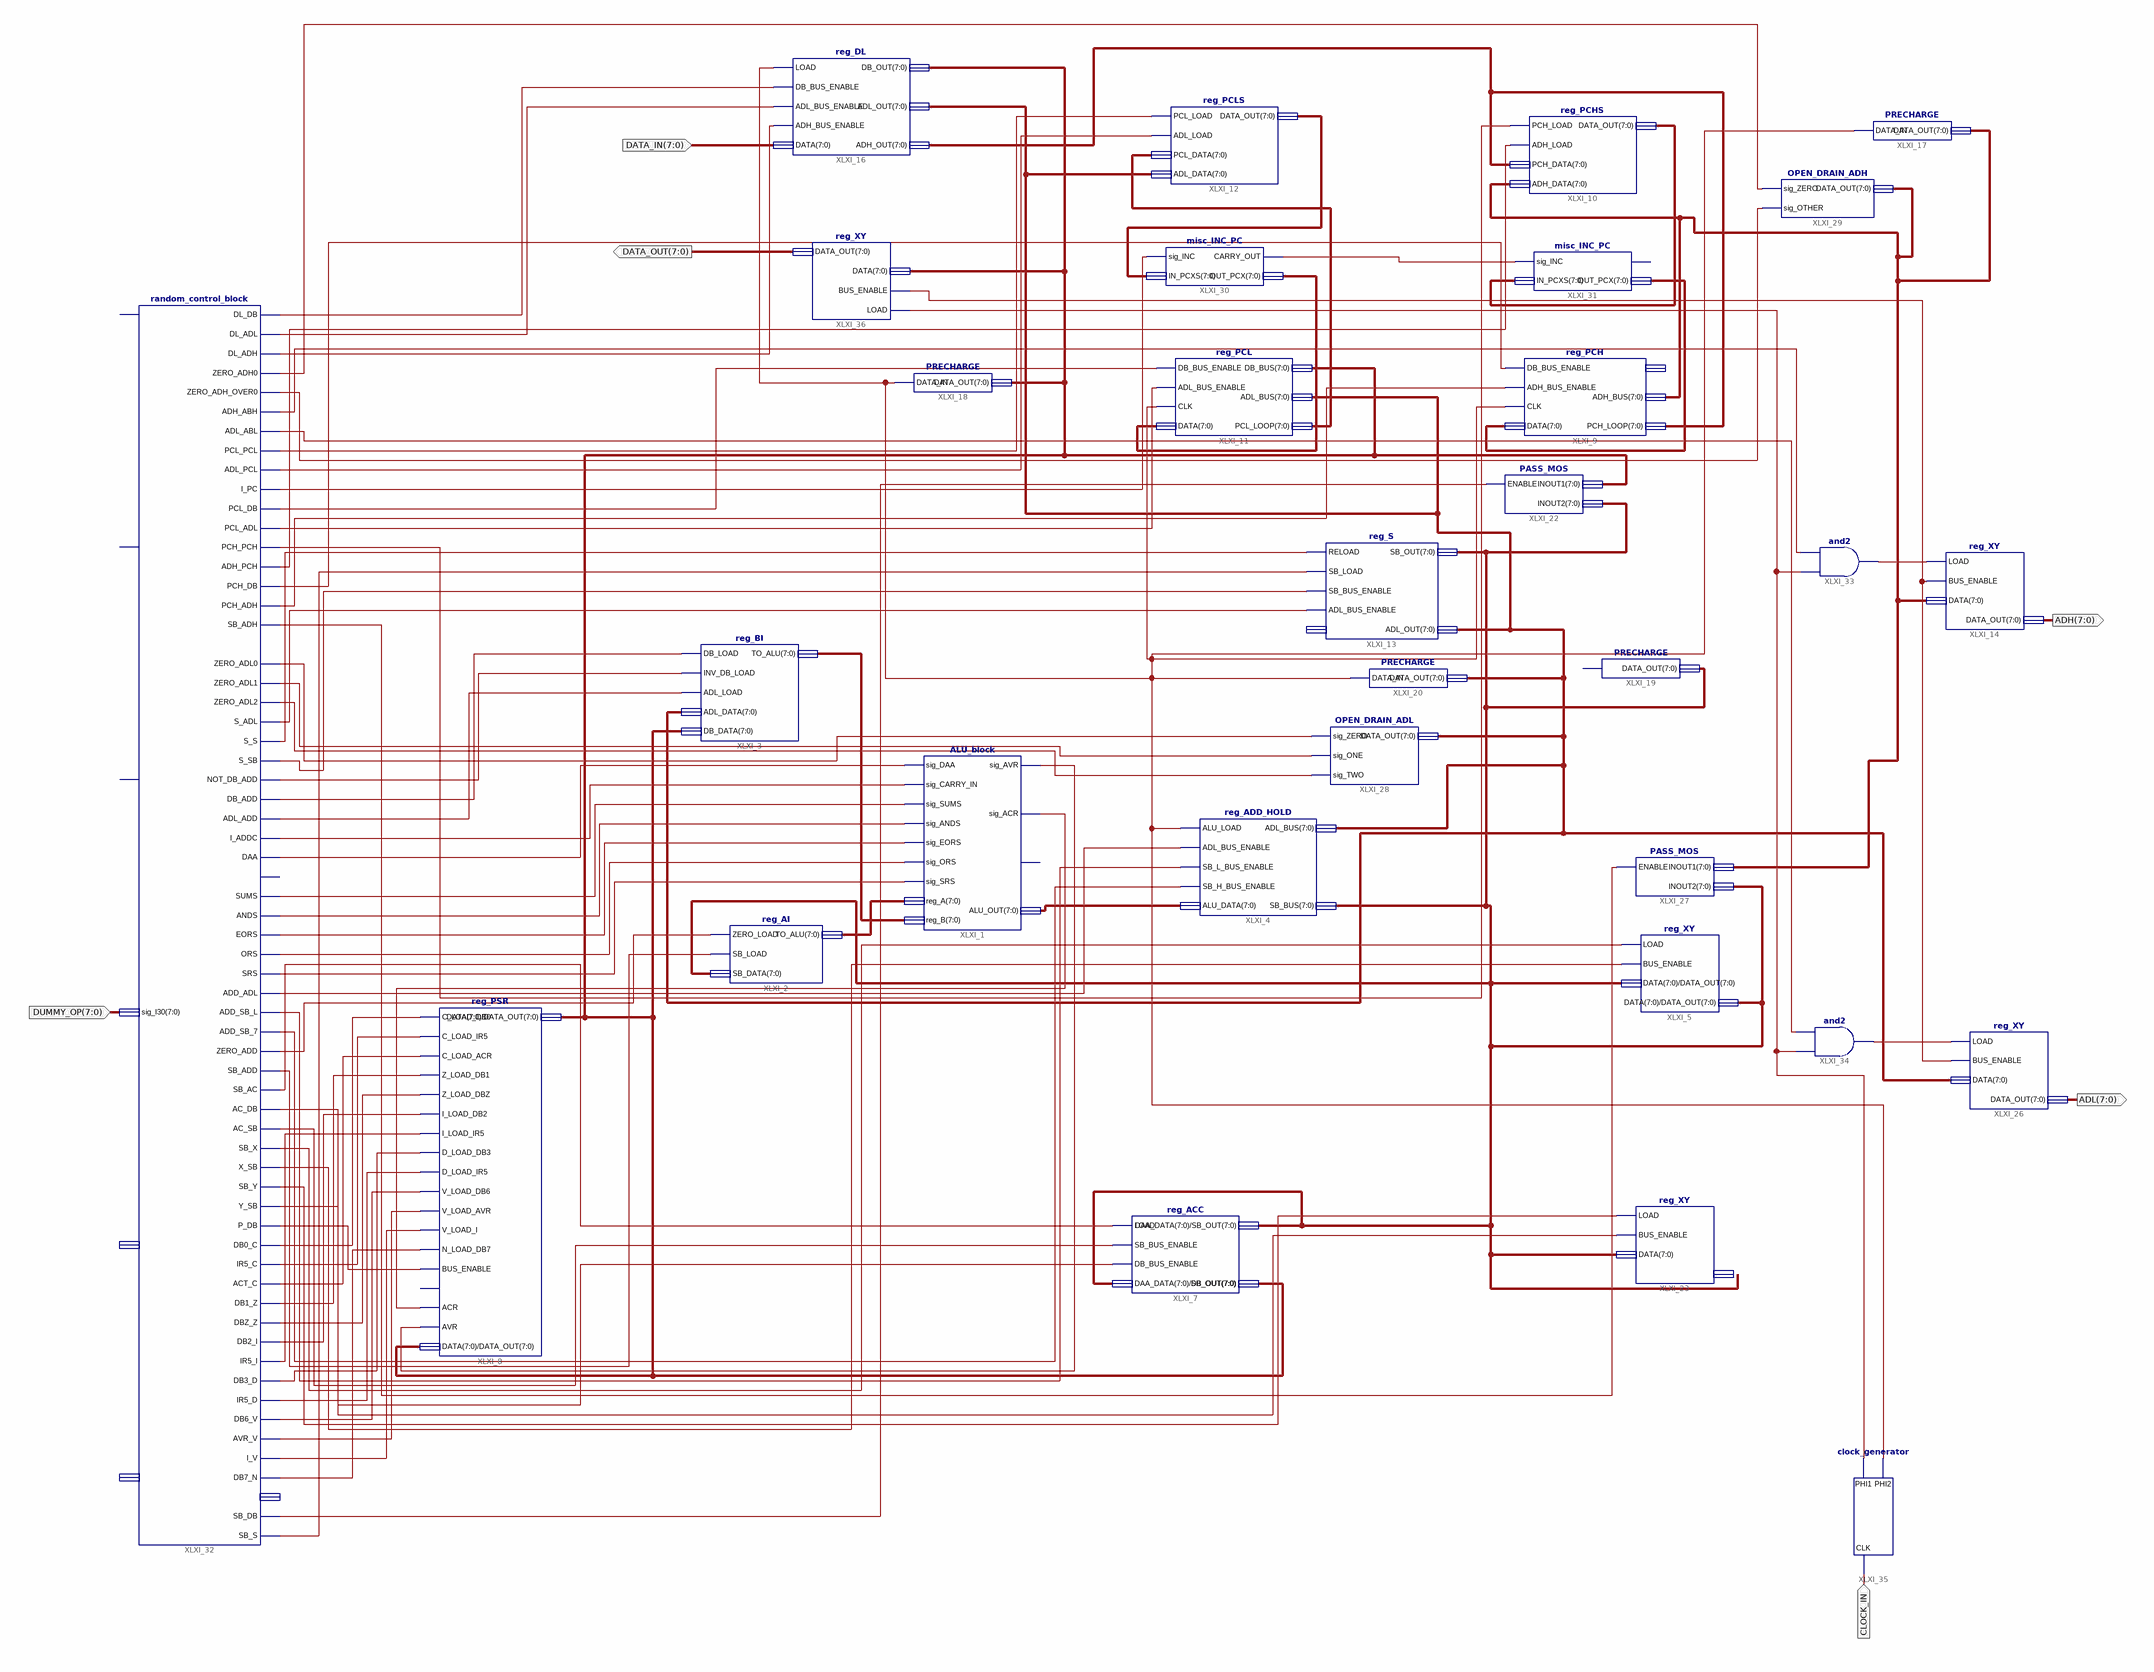
[diagram p0: schematic sheet 1]
// Xilinx ISE schematic cpu_dummy_one.sch (spartan6) as structural Verilog: 31 symbols, 6 ports
module cpu_dummy_one (
  input  [7:0] DATA_IN,
  input  CLOCK_IN,
  input  [7:0] DUMMY_OP,
  output [7:0] DATA_OUT,
  output [7:0] ADH,
  output [7:0] ADL
);

  wire XLXN_36, XLXN_37, XLXN_38, XLXN_39, XLXN_40, XLXN_41, XLXN_45, XLXN_46, XLXN_47, XLXN_48, XLXN_49,
       XLXN_50, XLXN_51, XLXN_52, XLXN_53, XLXN_54, XLXN_55, XLXN_56, XLXN_57, XLXN_59, XLXN_74, XLXN_75,
       XLXN_76, XLXN_77, XLXN_78, XLXN_79, XLXN_80, XLXN_81, XLXN_82, XLXN_83, XLXN_84, XLXN_85, XLXN_86,
       XLXN_87, XLXN_88, XLXN_91, XLXN_92, XLXN_93, XLXN_94, XLXN_95, XLXN_96, XLXN_97, XLXN_98, XLXN_99,
       XLXN_100, XLXN_101, XLXN_102, XLXN_103, XLXN_104, XLXN_105, XLXN_106, XLXN_107, XLXN_108, XLXN_109,
       XLXN_110, XLXN_111, XLXN_112, XLXN_113, XLXN_114, XLXN_115, XLXN_116, XLXN_117, XLXN_118, XLXN_119,
       XLXN_120, XLXN_219, XLXN_221, XLXN_228, XLXN_231;
  wire [7:0] XLXN_1, XLXN_2, XLXN_3, XLXN_5, XLXN_7, XLXN_8, XLXN_11, XLXN_17, XLXN_18, XLXN_32, XLXN_33,
       XLXN_34, XLXN_35;

  ALU_block XLXI_1 (
    .sig_DAA(XLXN_86), .sig_CARRY_IN(XLXN_85), .sig_SUMS(XLXN_87), .sig_ANDS(XLXN_88), .sig_EORS(XLXN_91),
    .sig_ORS(XLXN_92), .sig_SRS(XLXN_93), .reg_A(XLXN_1), .reg_B(XLXN_2), .sig_AVR(XLXN_95),
    .sig_ACR(XLXN_94), .ALU_OUT(XLXN_7));  // open: sig_HC
  reg_AI XLXI_2 (.ZERO_LOAD(XLXN_99), .SB_LOAD(XLXN_100), .SB_DATA(XLXN_3), .TO_ALU(XLXN_1));
  reg_BI XLXI_3 (
    .DB_LOAD(XLXN_83), .INV_DB_LOAD(XLXN_82), .ADL_LOAD(XLXN_84), .ADL_DATA(XLXN_8), .DB_DATA(XLXN_5),
    .TO_ALU(XLXN_2));
  reg_ADD_HOLD XLXI_4 (
    .ALU_LOAD(XLXN_228), .ADL_BUS_ENABLE(XLXN_96), .SB_L_BUS_ENABLE(XLXN_97), .SB_H_BUS_ENABLE(XLXN_98),
    .ALU_DATA(XLXN_7), .ADL_BUS(XLXN_8), .SB_BUS(XLXN_3));
  reg_XY XLXI_5 (.LOAD(XLXN_104), .BUS_ENABLE(XLXN_105), .DATA(XLXN_3), .DATA_OUT(XLXN_3));
  reg_ACC XLXI_7 (
    .LOAD(XLXN_101), .SB_BUS_ENABLE(XLXN_103), .DB_BUS_ENABLE(XLXN_102), .DAA_DATA(XLXN_3), .SB_OUT(XLXN_3),
    .DB_OUT(XLXN_5));
  reg_PSR XLXI_8 (
    .C_LOAD_DB0(XLXN_109), .C_LOAD_IR5(XLXN_110), .C_LOAD_ACR(XLXN_111), .Z_LOAD_DB1(XLXN_112),
    .Z_LOAD_DBZ(XLXN_113), .I_LOAD_DB2(XLXN_114), .I_LOAD_IR5(XLXN_219), .D_LOAD_DB3(XLXN_115),
    .D_LOAD_IR5(XLXN_116), .V_LOAD_DB6(XLXN_117), .V_LOAD_AVR(XLXN_118), .V_LOAD_I(XLXN_119),
    .N_LOAD_DB7(XLXN_120), .BUS_ENABLE(XLXN_108), .ACR(XLXN_94), .AVR(XLXN_95), .DATA(XLXN_5),
    .DATA_OUT(XLXN_5));  // open: IR5
  reg_PCH XLXI_9 (
    .DB_BUS_ENABLE(XLXN_56), .ADH_BUS_ENABLE(XLXN_57), .CLK(XLXN_228), .DATA(XLXN_35), .ADH_BUS(XLXN_11),
    .PCH_LOOP(XLXN_18));  // open: DB_BUS
  reg_PCHS XLXI_10 (.PCH_LOAD(XLXN_54), .ADH_LOAD(XLXN_55), .PCH_DATA(XLXN_18), .ADH_DATA(XLXN_11), .DATA_OUT(XLXN_34));
  reg_PCL XLXI_11 (
    .DB_BUS_ENABLE(XLXN_52), .ADL_BUS_ENABLE(XLXN_53), .CLK(XLXN_228), .DATA(XLXN_33), .DB_BUS(XLXN_5),
    .ADL_BUS(XLXN_8), .PCL_LOOP(XLXN_17));
  reg_PCLS XLXI_12 (.PCL_LOAD(XLXN_49), .ADL_LOAD(XLXN_50), .PCL_DATA(XLXN_17), .ADL_DATA(XLXN_8), .DATA_OUT(XLXN_32));
  reg_S XLXI_13 (
    .RELOAD(XLXN_79), .SB_LOAD(XLXN_81), .SB_BUS_ENABLE(XLXN_80), .ADL_BUS_ENABLE(XLXN_78), .SB_OUT(XLXN_3),
    .ADL_OUT(XLXN_8));  // open: SB_DATA
  reg_XY XLXI_14 (.LOAD(XLXN_46), .BUS_ENABLE(XLXN_231), .DATA(XLXN_11), .DATA_OUT(ADH));
  reg_DL XLXI_16 (
    .LOAD(XLXN_228), .DB_BUS_ENABLE(XLXN_37), .ADL_BUS_ENABLE(XLXN_38), .ADH_BUS_ENABLE(XLXN_39),
    .DATA(DATA_IN), .DB_OUT(XLXN_5), .ADL_OUT(XLXN_8), .ADH_OUT(XLXN_18));
  PRECHARGE XLXI_17 (.DATA_IN(XLXN_228), .DATA_OUT(XLXN_11));
  PRECHARGE XLXI_18 (.DATA_IN(XLXN_228), .DATA_OUT(XLXN_5));
  PRECHARGE XLXI_19 (.DATA_OUT(XLXN_3));  // open: DATA_IN
  PRECHARGE XLXI_20 (.DATA_IN(XLXN_228), .DATA_OUT(XLXN_8));
  PASS_MOS XLXI_22 (.ENABLE(XLXN_74), .INOUT1(XLXN_5), .INOUT2(XLXN_3));
  reg_XY XLXI_23 (.LOAD(XLXN_106), .BUS_ENABLE(XLXN_107), .DATA(XLXN_3));  // open: DATA_OUT
  reg_XY XLXI_26 (.LOAD(XLXN_47), .BUS_ENABLE(XLXN_231), .DATA(XLXN_8), .DATA_OUT(ADL));
  PASS_MOS XLXI_27 (.ENABLE(XLXN_59), .INOUT1(XLXN_11), .INOUT2(XLXN_3));
  OPEN_DRAIN_ADL XLXI_28 (.sig_ZERO(XLXN_75), .sig_ONE(XLXN_76), .sig_TWO(XLXN_77), .DATA_OUT(XLXN_8));
  OPEN_DRAIN_ADH XLXI_29 (.sig_ZERO(XLXN_40), .sig_OTHER(XLXN_41), .DATA_OUT(XLXN_11));
  misc_INC_PC XLXI_30 (.sig_INC(XLXN_51), .IN_PCXS(XLXN_32), .CARRY_OUT(XLXN_36), .OUT_PCX(XLXN_33));
  misc_INC_PC XLXI_31 (.sig_INC(XLXN_36), .IN_PCXS(XLXN_34), .OUT_PCX(XLXN_35));  // open: CARRY_OUT
  random_control_block XLXI_32 (
    .sig_I30(DUMMY_OP), .DL_DB(XLXN_37), .DL_ADL(XLXN_38), .DL_ADH(XLXN_39), .ZERO_ADH0(XLXN_40),
    .ZERO_ADH_OVER0(XLXN_41), .ADH_ABH(XLXN_45), .ADL_ABL(XLXN_48), .PCL_PCL(XLXN_49), .ADL_PCL(XLXN_50),
    .I_PC(XLXN_51), .PCL_DB(XLXN_52), .PCL_ADL(XLXN_53), .PCH_PCH(XLXN_54), .ADH_PCH(XLXN_55),
    .PCH_DB(XLXN_56), .PCH_ADH(XLXN_57), .SB_ADH(XLXN_59), .SB_DB(XLXN_74), .ZERO_ADL0(XLXN_75),
    .ZERO_ADL1(XLXN_76), .ZERO_ADL2(XLXN_77), .S_ADL(XLXN_78), .S_S(XLXN_79), .S_SB(XLXN_80),
    .NOT_DB_ADD(XLXN_82), .DB_ADD(XLXN_83), .ADL_ADD(XLXN_84), .I_ADDC(XLXN_85), .DAA(XLXN_86),
    .SUMS(XLXN_87), .ANDS(XLXN_88), .EORS(XLXN_91), .ORS(XLXN_92), .SRS(XLXN_93), .ADD_ADL(XLXN_96),
    .ADD_SB_L(XLXN_97), .ADD_SB_7(XLXN_98), .ZERO_ADD(XLXN_99), .SB_ADD(XLXN_100), .SB_AC(XLXN_101),
    .AC_DB(XLXN_102), .AC_SB(XLXN_103), .SB_X(XLXN_104), .X_SB(XLXN_105), .SB_Y(XLXN_106), .Y_SB(XLXN_107),
    .P_DB(XLXN_108), .DB0_C(XLXN_109), .IR5_C(XLXN_110), .ACT_C(XLXN_111), .DB1_Z(XLXN_112),
    .DBZ_Z(XLXN_113), .DB2_I(XLXN_114), .IR5_I(XLXN_219), .DB3_D(XLXN_115), .IR5_D(XLXN_116),
    .DB6_V(XLXN_117), .AVR_V(XLXN_118), .I_V(XLXN_119), .DB7_N(XLXN_120), .SB_S(XLXN_81));  // open: sig_RDY, sig_R_NOT_W, sig_SV, sig_interrupt, timing_IN, DSA, timing_OUT
  and XLXI_33 (XLXN_46, XLXN_221, XLXN_45);
  and XLXI_34 (XLXN_47, XLXN_221, XLXN_48);
  clock_generator XLXI_35 (.CLK(CLOCK_IN), .PHI1(XLXN_221), .PHI2(XLXN_228));
  reg_XY XLXI_36 (.LOAD(XLXN_221), .BUS_ENABLE(XLXN_231), .DATA(XLXN_5), .DATA_OUT(DATA_OUT));
endmodule
